# Altium schematic sheet Counter_Switch.SchDoc
size Letter; SheetNumber: 2; SheetTotal: 2
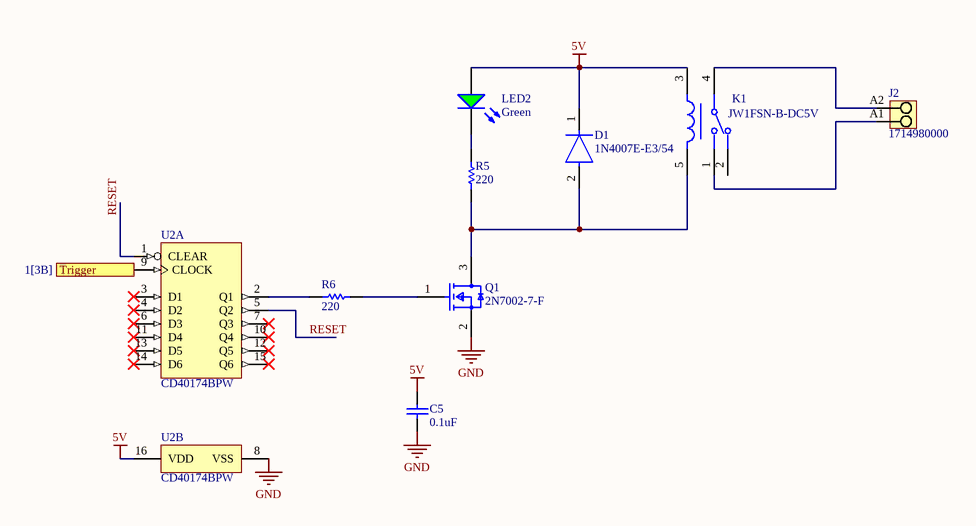
[diagram p0: Counter_Switch.SchDoc]

## Parts
C5  0.1uF  [CAPC2013X145X50ML20T20]
D1  1N4007E-E3/54  [FP-1N4007E-E3-54-MFG]
J2  1714980000  [LM_3_5_135_02]
K1  JW1FSN-B-DC5V  [FP-JW1FSN-B-DC5V-MFG]
LED2  Green  [KING-WP7113SGD_V]
Q1  2N7002-7-F  [FP-SOT23-IPC_A]
R5  220  [RESC2013X60X30NL20T20]
R6  220  [RESC2013X60X30NL20T20]
U2  CD40174BPW  [PW0016A_M]  (parts A,B of 2)

## Ports
Trigger (in, see 1[3B])

## Nets
5V: C5.2 D1.1(C) K1.3 LED2.1(A) U2.16(VDD)
GND: C5.1 Q1.2(S) U2.8(VSS)
RESET: U2.1(CLEAR) U2.5(Q2)
Trigger: U2.9(CLOCK) ; port Trigger
NetD1_2: D1.2(A) K1.5 Q1.3(D) R5.1
NetJ2_A1: J2.A1 K1.1
NetJ2_A2: J2.A2 K1.4
NetLED2_2: LED2.2(K) R5.2
NetQ1_1: Q1.1(G) R6.2
NetR6_1: R6.1 U2.2(Q1)

Not connected (* = marked no-connect by the designer): K1 2; U2 3(D1)* 4(D2)* 6(D3)* 7(Q3)* 10(Q4)* 11(D4)* 12(Q5)* 13(D5)* 14(D6)* 15(Q6)*

## Library data of the parts
C5 = CAP 0.1uF 10V 0805: Manufacturer: Vitramon; Part Number: VJ0805Y104MXQCW1BC
D1 = Diode General Purpose 1N4007: DIODE GEN PURP 1KV 1A DO204AL; Peak Non-Repetitive Surge Current: 45A; Forward Voltage: 1.1V; Element Configuration: Single; Max Reverse Current: 5uA; Max Repetitive Reverse Voltage (Vrrm): 1kV; RoHS Compliant: Yes; Max Surge Current: 45A; Min Operating Temperature: -50°C; Radiation Hardening: No; Average Rectified Current: 1A; Series: -; Packaging: Tape and Reel; Contact Plating: Tin; Package Quantity: 5500; Max Reverse Voltage (DC): 1kV; Reverse Voltage: 1kV; Number of Pins: 2; Max Operating Temperature: 150°C; Case/Package: DO-41; Mount: Through Hole
J2 = Terminal Block 2Pos: OMNIMATE Signal - series LM; Manufacturer: Weidmueller; Pitch_inch: 0,138 inch; Solder_pin_length_mm: 3,2 mm; Wire_cross_section_AWG_min_UL_1059: AWG 28; Wire_cross_section_AWG_max_UL_1059: AWG 14; Side_termination_characteristic: closed side; Insulating_material: PA; Pitch_mm: 3,5 mm; Contact_material: Cu-Leg; No_of_poles: 2; Mounting_onto_the_PCB: Solder connection; Short_text_for_material: LM 3.50/02/135 3.2SN OR BX; Rated_voltage_for_surge_voltage_class_pollution_degree_II_2: 320 V; Solid_min_H05_07_V_U: 0,5 mm²; Solid_max_H05_07_V_U: 1,5 mm²; Rated_current_use_group_B_UL_1059: 10 A; UL_94_flammability_rating: V-2; Contact_surface: tinned; Rated_voltage_use_group_B_UL_1059: 300 V; Colour: Orange; ComponentLink1Description: Manufacturer URL; ComponentLink2URL: http://catalog.weidmueller.com/catalog/Start.do?localeId=en&ObjectID=1714980000; PartNumber: 1714980000; Packaging: Box; ComponentLink1URL: http://www.weidmueller.com/; ComponentLink2Description: URL Link1; PackageReference: LM_3_5_135_02; Qty: 100 PCS; Revision: V1
K1 = RELAY SPDT 5V: RELAY GEN PURPOSE SPDT 10A 5V; Ratings: IP67; Operate Time: 15ms; Coil Type: Non-Latching; Max Voltage Rating (DC): 30V; Voltage Rating (AC): 250V; Coil Current: 106mA; Coil Resistance: 47R; Relay Type: General Purpose; Switching Capacity: 300W; Test Voltage: 5kV; Power Consumption: 530mW; Release Time: 5ms; Length: 28.6mm; Mount: Through Hole; Min Operating Temperature: -40°C; Package Quantity: 100; RoHS Compliant: Yes; Max Current Rating: 10A; Coil Voltage (DC): 5V; Series: JW; Switching Current: 10A; Contact Material: Silver; Throw Configuration: SPDT; Packaging: Bulk; Voltage Rating (DC): 30V; Contact Current Rating: 10A; Max Voltage Rating (AC): 250V; Depth: 12.8mm; Termination: PC Pin; Number of Pins: 5; Lead Free: Lead Free; Max Operating Temperature: 85°C; Coil Power: 530mW; Radiation Hardening: No
LED2 = LED 5mm Green: LED Green, 62.5 mW, 25 mA, -40 to 85 degC, 2-Pin THD, RoHS, Bulk; Manufacturer: Kingbright; Viewing Angle: 30degrees; Lens Style: Tinted; Test Current: 20mA; Forward Voltage: 2.2V; Wavelength: 568nm; Luminous Intensity: 40mcd; Package Reference: WP7113SGD; Colour: Green; Lead Free: LeadFree; Packaging: Bulk; RoHSCompliant: true; Package Quantity: 1000; Illumination Colour: Green; Case/Package: Radial; Datasheet URL: http://www.kingbrightusa.com/images/catalog/SPEC/WP7113SGD.pdf; Dominant Wavelength: 568nm; Datasheet Version: Rev. 6B, 01/2015; Package Description: 2-Pin Through Hole Device, Dia 5.9 mm, Body Length 8.6 mm; Height: 8.6mm
Q1 = MOSFET 2N7002 SMD: MOSFET N-CH 60V 115MA SOT23-3; Turn-On Delay Time: 7ns; Turn-Off Delay Time: 11ns; Drain to Source Resistance: 7.5R; Rise Time: 3ns; Drain to Source Breakdown Voltage: 70V; Input Capacitance: 50pF; Number of Elements: 1; Power Dissipation: 540mW; Max Power Dissipation: 300mW; Fall Time: 5.6ns; Gate to Source Voltage (Vgs): 20V; Threshold Voltage: 2.5V; Element Configuration: Single; Termination: SMD/SMT; Weight: 0.000282oz; Radiation Hardening: No; Max Operating Temperature: 150°C; On-State Resistance: 7.5R; Mount: Surface Mount; Current Rating: 115mA; Contact Plating: Tin; Lead Free: Lead Free; Min Operating Temperature: -55°C; Number of Pins: 3; REACH SVHC: No SVHC; Drain to Source Voltage (Vdss): 60V; Width: 1.3mm; Package Quantity: 3000; Length: 2.9mm; Case/Package: SOT-23; Number of Channels: 1; Dual Supply Voltage: 60V; Packaging: Tape and Reel; Height: 1mm; Voltage Rating (DC): 60V; Nominal Vgs: 2.5V; Continuous Drain Current (ID): 115mA; Voltage: 60V; Rds On Max: 7.5R
R5 R6 = Res 220 Ohm 0.25W SMD: Part Number: SG73S2ATTD2200F; Manufacturer: KOA Speer
U2 = IC CD4071: CMOS Hex D-Type Flip-Flop, PW0016A, TUBE; Manufacturer: Texas Instruments; tpd @ Nom Voltage(Max)(ns): 140; VCC(Min)(V): 3; Output Logic: Non-inverted; Voltage(Nom)(V): 10; F @ Nom Voltage(Max)(Mhz): 8; Output Drive (IOL/IOH)(Max)(mA): 1.5/-1.5; ICC @ Nom Voltage(Max)(mA): 0.06; 3-State Output: No; VCC(Max)(V): 18; Technology Family: CD4000; Rating: Catalog; Bits(#): 6; Code_JEDEC: MO-153; Input Type: CMOS; PackageReference: PW0016A; DatasheetVersion: SCHS104C; Generic Part Number: CD40174B; Schmitt Trigger: No; Operating Temperature Range(C): -55 to 125; Output Type: CMOS